# Altium schematic sheet Sheet1.SchDoc
size A2; SheetNumber: 1; SheetTotal: 1
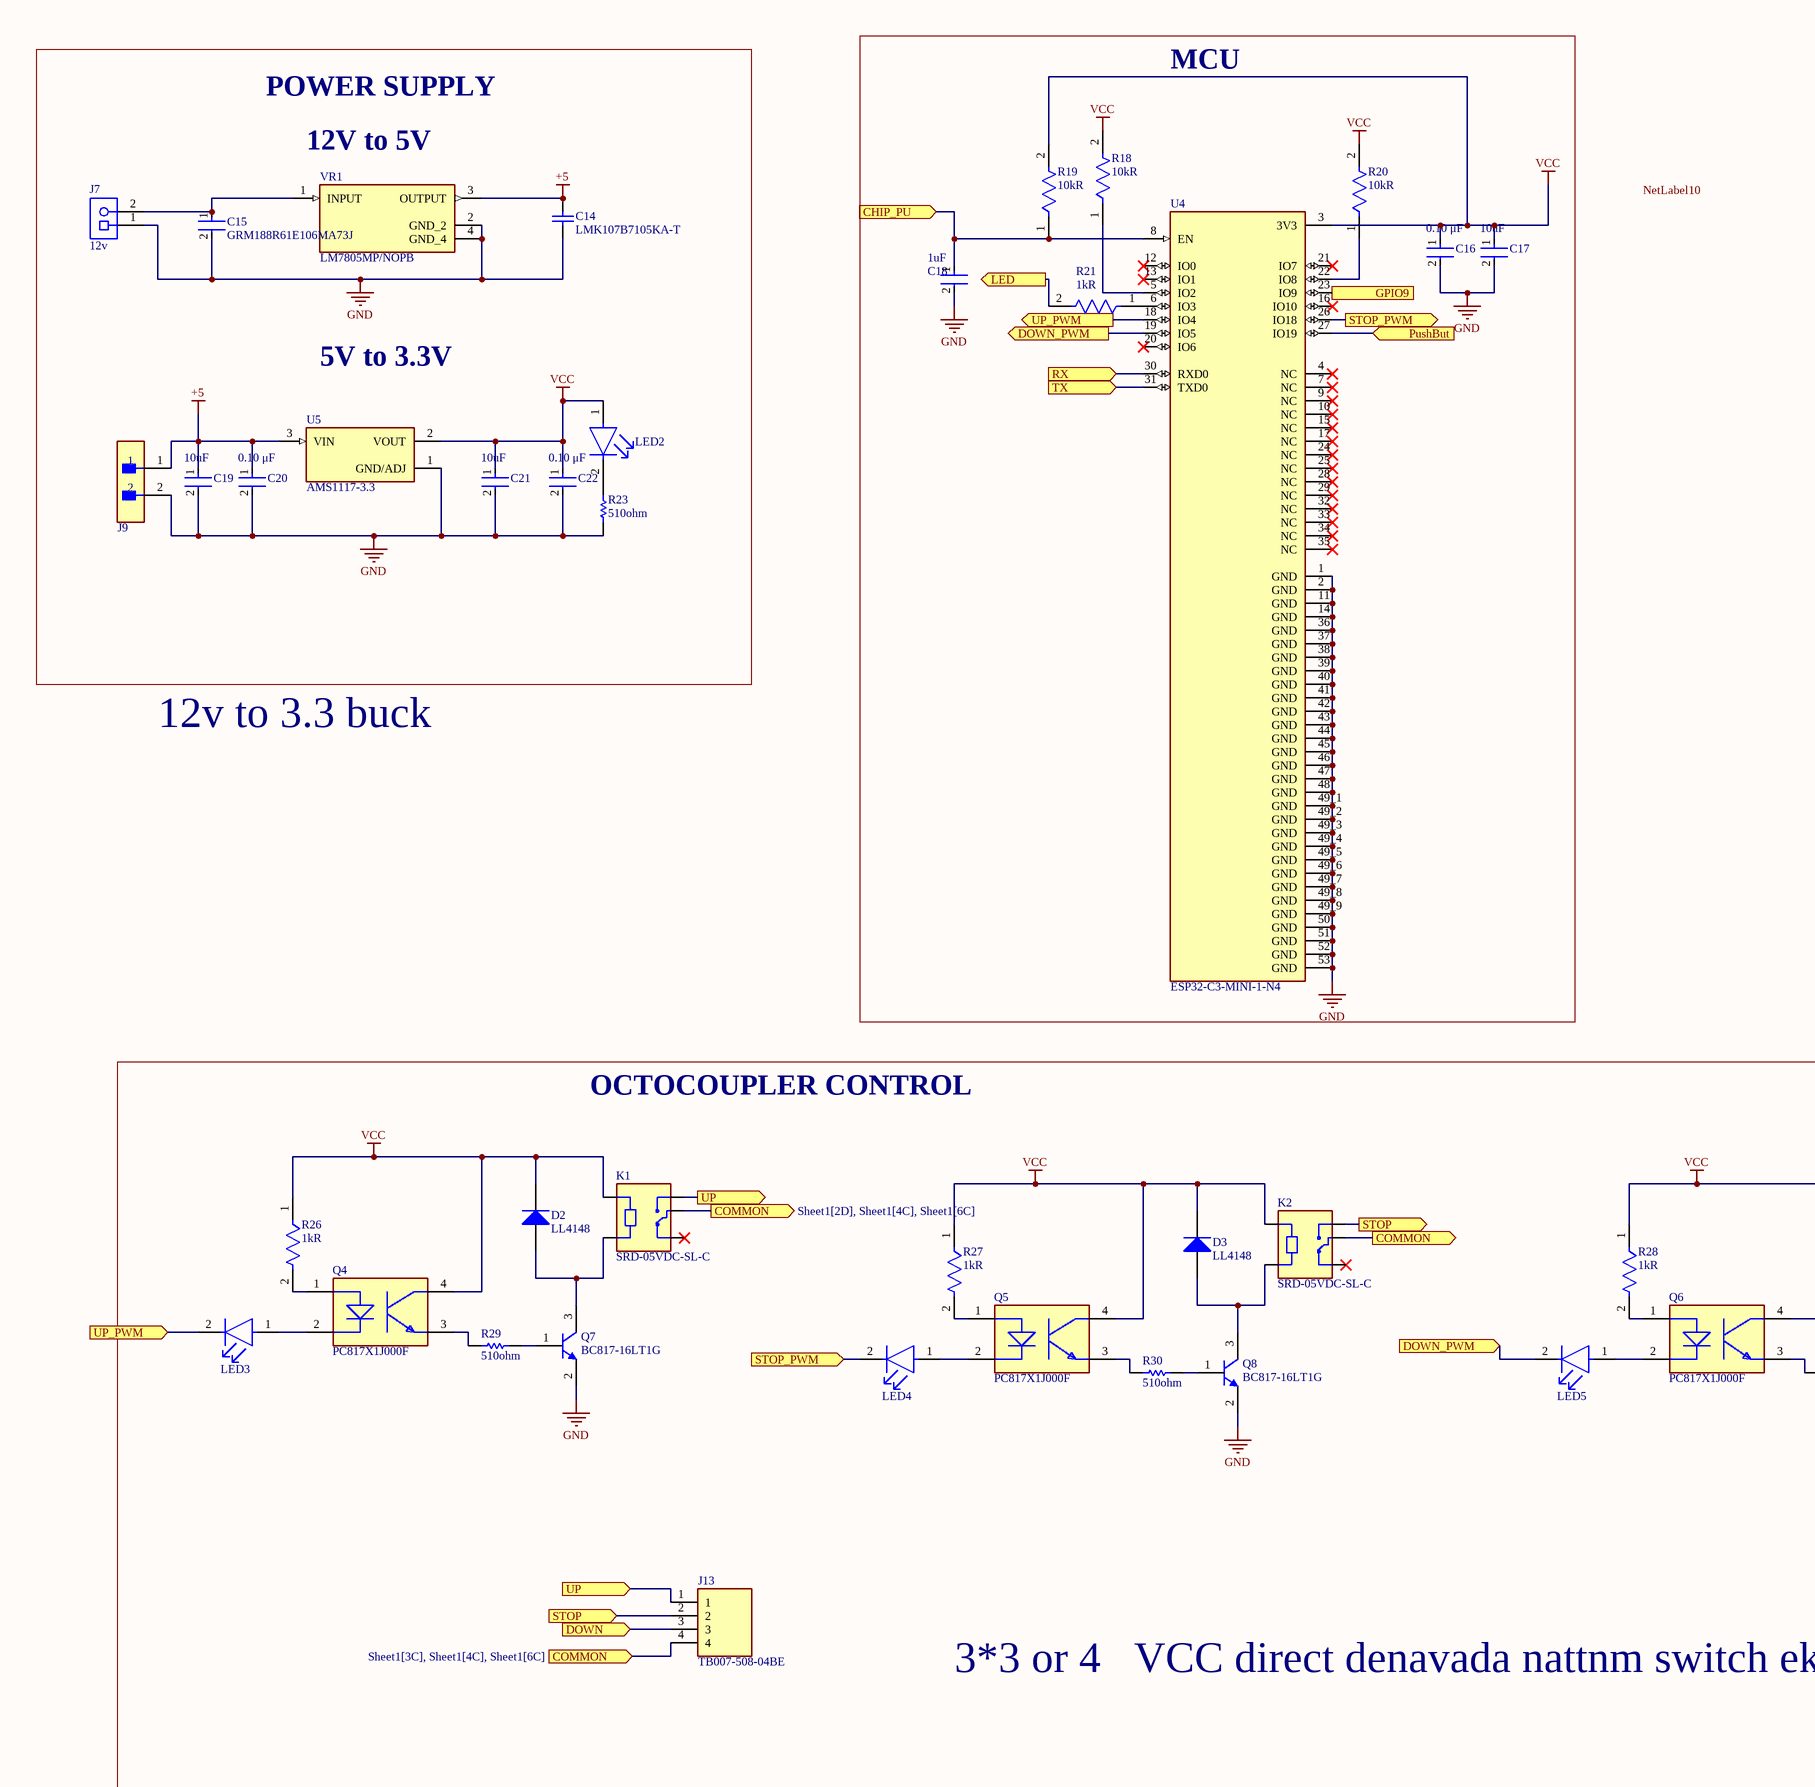
[diagram p0: Sheet1.SchDoc, left]
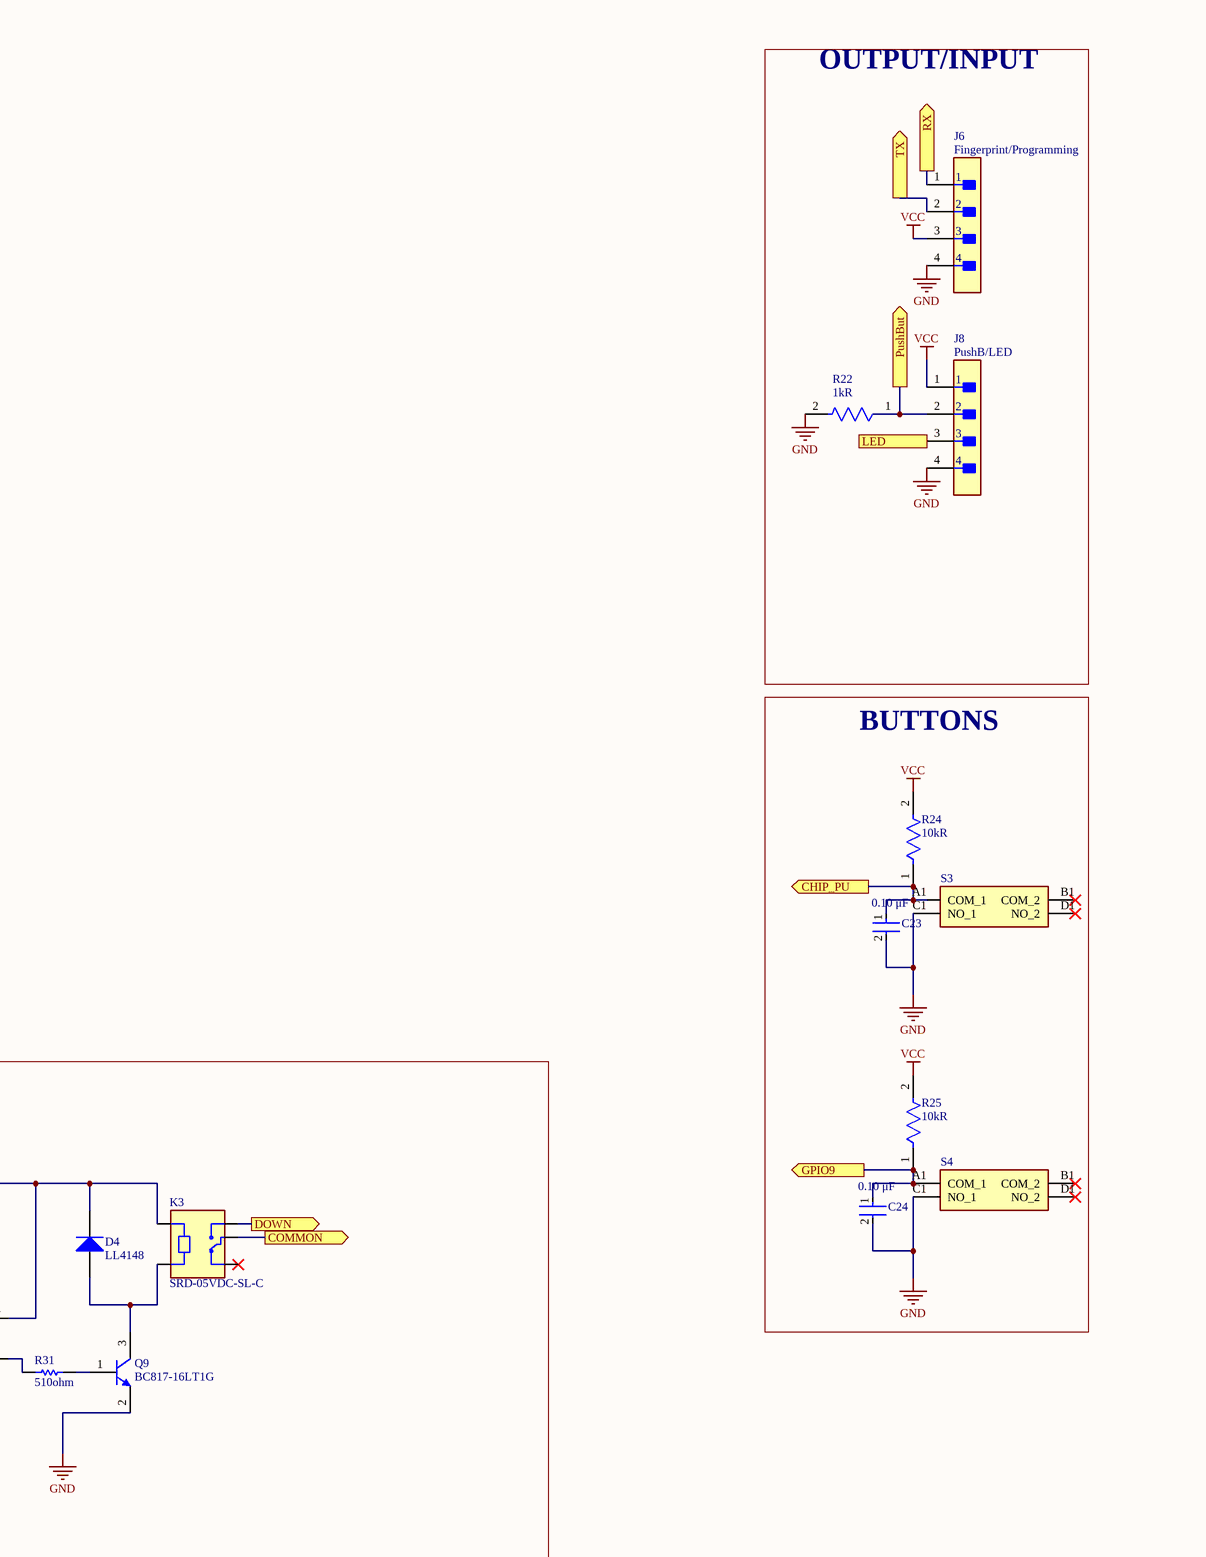
[diagram p1: Sheet1.SchDoc, right]

## Parts
C14  LMK107B7105KA-T  [CAPC1608X90X35NL10T25]
C15  GRM188R61E106MA73J  [FP-GRM188-0_2-MFG]
C16  Capacitance: 0.10 μF  [FP-C0603C-CF-MFG]  (hidden comment: C0603C104M4RAC7411)
C17  Capacitance: 10uF  [FP-CL10-IPC_A]  (hidden comment: CL10X106MO8NRNC)
C18  Capacitance: 1uF  [FP-0603-L_1_6_0_1-W_0_8_0-IPC_C]  (hidden comment: EMK107B7105KA-T)
C19  Capacitance: 10uF  [FP-CL10-IPC_A]  (hidden comment: CL10X106MO8NRNC)
C20  Capacitance: 0.10 μF  [FP-C0603C-CF-MFG]  (hidden comment: C0603C104M4RAC7411)
C21  Capacitance: 10uF  [FP-CL10-IPC_A]  (hidden comment: CL10X106MO8NRNC)
C22  Capacitance: 0.10 μF  [FP-C0603C-CF-MFG]  (hidden comment: C0603C104M4RAC7411)
C23  Capacitance: 0.10 μF  [FP-C0603C-CF-MFG]  (hidden comment: C0603C104M4RAC7411)
C24  Capacitance: 0.10 μF  [FP-C0603C-CF-MFG]  (hidden comment: C0603C104M4RAC7411)
D2  LL4148  [FAIR-SOD80-2_V]
D3  LL4148  [FAIR-SOD80-2_V]
D4  LL4148  [FAIR-SOD80-2_V]
J6  value Fingerprint/Programming  [FP-B4B-XH-A_LF_SN-MFG]  (hidden comment: B4B-XH-A(LF)(SN))
J7  Parameter 1: 12v  [PHOE-1729128-2_V]  (hidden comment: 1729128)
J8  value PushB/LED  [FP-B4B-XH-A_LF_SN-MFG]  (hidden comment: B4B-XH-A(LF)(SN))
J9  B2B-EH-A(LF)(SN)  [FP-B2B-EH-A_LF_SN-MFG]  (value not drawn)
J13  TB007-508-04BE  [CUI_TB007-508-04BE]
K1  SRD-05VDC-SL-C  [RELAY_SRD-05VDC-SL-C]
K2  SRD-05VDC-SL-C  [RELAY_SRD-05VDC-SL-C]
K3  SRD-05VDC-SL-C  [RELAY_SRD-05VDC-SL-C]
LED2  SM0805UBWC  [FP-SM0805UBWC-MFG]  (value not drawn)
LED3  SM0805UBWC  [FP-SM0805UBWC-MFG]  (value not drawn)
LED4  SM0805UBWC  [FP-SM0805UBWC-MFG]  (value not drawn)
LED5  SM0805UBWC  [FP-SM0805UBWC-MFG]  (value not drawn)
Q4  PC817X1J000F  [FP-PC817X1J000F-MFG]
Q5  PC817X1J000F  [FP-PC817X1J000F-MFG]
Q6  PC817X1J000F  [FP-PC817X1J000F-MFG]
Q7  BC817-16LT1G  [ONSC-SOT-23-3-318-08_V]
Q8  BC817-16LT1G  [ONSC-SOT-23-3-318-08_V]
Q9  BC817-16LT1G  [ONSC-SOT-23-3-318-08_V]
R18  Resistance: 10kR  [FP-ESR03-IPC_C]  (hidden comment: ESR03EZPJ103)
R19  Resistance: 10kR  [FP-ESR03-IPC_C]  (hidden comment: ESR03EZPJ103)
R20  Resistance: 10kR  [FP-ESR03-IPC_C]  (hidden comment: ESR03EZPJ103)
R21  Parameter 1: 1kR  [FP-ESR03-IPC_C]  (hidden comment: ESR03EZPJ103)
R22  Parameter 1: 1kR  [FP-ESR03-IPC_C]  (hidden comment: ESR03EZPJ103)
R23  Parameter 1: 510ohm  [RESC1609X50X30NL10T20]  (hidden comment: CRCW0603510RFKEA)
R24  Resistance: 10kR  [FP-ESR03-IPC_C]  (hidden comment: ESR03EZPJ103)
R25  Resistance: 10kR  [FP-ESR03-IPC_C]  (hidden comment: ESR03EZPJ103)
R26  Parameter 1: 1kR  [FP-ESR03-IPC_C]  (hidden comment: ESR03EZPJ103)
R27  Parameter 1: 1kR  [FP-ESR03-IPC_C]  (hidden comment: ESR03EZPJ103)
R28  Parameter 1: 1kR  [FP-ESR03-IPC_C]  (hidden comment: ESR03EZPJ103)
R29  Parameter 1: 510ohm  [RESC1609X50X30NL10T20]  (hidden comment: CRCW0603510RFKEA)
R30  Parameter 1: 510ohm  [RESC1609X50X30NL10T20]  (hidden comment: CRCW0603510RFKEA)
R31  Parameter 1: 510ohm  [RESC1609X50X30NL10T20]  (hidden comment: CRCW0603510RFKEA)
S3  TS-1187A-B-A-B  [TS1187ABAB]  (value not drawn)
S4  TS-1187A-B-A-B  [TS1187ABAB]  (value not drawn)
U4  ESP32-C3-MINI-1-N4  [XCVR_ESP32-C3-MINI-1-N4]
U5  AMS1117-3.3  [SOT229P700X180-4N]
VR1  LM7805MP/NOPB  [VREG_LM7805MP/NOPB]

## Blocks framed on the sheet
MCU: C16-C18 R18-R21 U4
OUTPUT/INPUT: J6 J8 R22
BUTTONS: C23 C24 R24 R25 S3 S4
OCTOCOUPLER CONTROL: D2-D4 J13 K1-K3 LED3-LED5 Q4-Q9 R26-R31

## Ports
CHIP_PU (in, see Sheet1[7B]), CHIP_PU (out, see Sheet1[3A]), COMMON (in, see Sheet1[3C], Sheet1[4C], Sheet1[6C]), COMMON (out, see Sheet1[2D], Sheet1[3C], Sheet1[4C]), COMMON (out, see Sheet1[2D], Sheet1[3C], Sheet1[6C]), COMMON (out, see Sheet1[2D], Sheet1[4C], Sheet1[6C]), DOWN (in, see Sheet1[6C]), DOWN (out, see Sheet1[2D]), DOWN_PWM (in, see Sheet1[3A]), DOWN_PWM (out, see Sheet1[4C]), GPIO9 (in, see Sheet1[7C]), GPIO9 (out, see Sheet1[4A]), LED (in, see Sheet1[3A]), LED (out, see Sheet1[8A]), PushBut (in, see Sheet1[8A]), PushBut (out, see Sheet1[4A]), RX (in, see Sheet1[8A]), RX (out, see Sheet1[3A]), STOP (in, see Sheet1[4C]), STOP (out, see Sheet1[2D]), STOP_PWM (in, see Sheet1[4A]), STOP_PWM (out, see Sheet1[3C]), TX (in, see Sheet1[8A]), TX (out, see Sheet1[3A]), UP (in, see Sheet1[2C]), UP (out, see Sheet1[2D]), UP_PWM (in, see Sheet1[3A]), UP_PWM (out, see Sheet1[1C])

## Nets
+5: C14.2 C19.1 C20.1 J9.1 U5.3(VIN) VR1.3(OUTPUT)
GND: C14.1 C15.2 C16.2 C17.2 C18.2 C19.2 C20.2 C21.2 C22.2 C23.2 C24.2 J6.4 J7.1 J8.4 J9.2 Q7.2(E) Q8.2(E) Q9.2(E) R22.2 R23.1 S3.C1(NO_1) S4.C1(NO_1) U4.1(GND) U4.2(GND) U4.11(GND) U4.14(GND) U4.36(GND) U4.37(GND) U4.38(GND) U4.39(GND) U4.40(GND) U4.41(GND) U4.42(GND) U4.43(GND) U4.44(GND) U4.45(GND) U4.46(GND) U4.47(GND) U4.48(GND) U4.49_1(GND) U4.49_2(GND) U4.49_3(GND) U4.49_4(GND) U4.49_5(GND) U4.49_6(GND) U4.49_7(GND) U4.49_8(GND) U4.49_9(GND) U4.50(GND) U4.51(GND) U4.52(GND) U4.53(GND) U5.1(GND/ADJ) VR1.2(GND_2) VR1.4(GND_4)
VCC: C16.1 C17.1 C21.1 C22.1 D2.2(K) D3.2(K) D4.2(K) J6.3 J8.1 K1.A1 K2.A1 K3.A1 LED2.1(A) Q4.4(C) Q5.4(C) Q6.4(C) R18.2 R19.2 R20.2 R24.2 R25.2 R26.1 R27.1 R28.1 U4.3(3V3) U5.2(VOUT)
CHIP_PU: C18.1 C23.1 R19.1 R24.1 S3.A1(COM_1) U4.8(EN) ; port CHIP_PU
COMMON: J13.4 K1.COM K2.COM K3.COM ; port COMMON
DOWN: J13.3 K3.NO ; port DOWN
DOWN_PWM: LED5.2(C) U4.19(IO5) ; port DOWN_PWM
GPIO9: C24.1 R25.1 S4.A1(COM_1) U4.23(IO9) ; port GPIO9
LED: J8.3 R21.2 ; port LED
PushBut: J8.2 R22.1 U4.27(IO19) ; port PushBut
RX: J6.1 U4.30(RXD0) ; port RX
STOP: J13.2 K2.NO ; port STOP
STOP_PWM: LED4.2(C) U4.26(IO18) ; port STOP_PWM
TX: J6.2 U4.31(TXD0) ; port TX
UP: J13.1 K1.NO ; port UP
UP_PWM: LED3.2(C) U4.18(IO4) ; port UP_PWM
NetC15_1: C15.1 J7.2 VR1.1(INPUT)
NetD2_1: D2.1(A) K1.A2 Q7.3(C)
NetD3_1: D3.1(A) K2.A2 Q8.3(C)
NetD4_1: D4.1(A) K3.A2 Q9.3(C)
NetLED2_2: LED2.2(C) R23.2
NetLED3_1: LED3.1(A) Q4.2(C)
NetLED4_1: LED4.1(A) Q5.2(C)
NetLED5_1: LED5.1(A) Q6.2(C)
NetQ4_1: Q4.1(A) R26.2
NetQ4_3: Q4.3(E) R29.2
NetQ5_1: Q5.1(A) R27.2
NetQ5_3: Q5.3(E) R30.2
NetQ6_1: Q6.1(A) R28.2
NetQ6_3: Q6.3(E) R31.2
NetQ7_1: Q7.1(B) R29.1
NetQ8_1: Q8.1(B) R30.1
NetQ9_1: Q9.1(B) R31.1
NetR18_1: R18.1 U4.5(IO2)
NetR20_1: R20.1 U4.22(IO8)
NetR21_1: R21.1 U4.6(IO3)

Not connected (* = marked no-connect by the designer): K1 NC*; K2 NC*; K3 NC*; S3 B1(COM_2)* D1(NO_2)*; S4 B1(COM_2)* D1(NO_2)*; U4 4(NC)* 7(NC)* 9(NC)* 10(NC)* 12(IO0)* 13(IO1)* 15(NC)* 16(IO10)* 17(NC)* 20(IO6)* 21(IO7)* 24(NC)* 25(NC)* 28(NC)* 29(NC)* 32(NC)* 33(NC)* 34(NC)* 35(NC)*

## Notes on the sheet
- POWER SUPPLY
- (near VR1) 12V to 5V
- 5V to 3.3V
- 12v to 3.3 buck
- 3*3 or 4   VCC direct denavada nattnm switch ekak vidiyata danavda  and led ekak damavda nadda?
- Labels drawn without touching a wire or pin: NetLabel10

## Library data of the parts
C14 = CMP-2000-05445-2: None; Dielectric: X7R; Tolerance: 10%; Voltage Rating: 10V; Capacitance: 1uF; Halogen Free: Halogen Free; Construction: Flat; Max Operating Temperature: 125°C; Packaging: Tape and Reel; REACH SVHC: No SVHC; Width: 0.031inch; Case/Package: 0603; Number of Pins: 2; Resistor Type: Ceramic; Case Code (Imperial): 0603; Termination: SMD/SMT; RoHS Compliant: Yes; Depth: 0.8mm; Height: 0.8mm; Mount: Surface Mount; Case Code (Metric): 1608; Voltage Rating (DC): 10V; Series: M; Length: 1.6mm; Radiation Hardening: No; Lead Free: Lead Free; Min Operating Temperature: -55°C; Thickness: 0.035inch; Package Quantity: 1
C15 = CMP-06035-029786-1: Chip Multilayer Ceramic Capacitors for General Purpose, 0603, 10uF, X5R, 15%, 20%, 25V; Termination: SMD/SMT; Weight: 0.000222oz; Mount: Surface Mount; Package Quantity: 10000; Voltage Rating (DC): 25V; Length: 0.063inch; Case Code (Metric): 1608; Thickness: 0.039inch; Height: 0.8mm; Resistor Type: Ceramic; Dielectric: X5R; Case/Package: 0603; Tolerance: 20%; Packaging: Tape and Reel; Width: 0.031inch; Case Code (Imperial): 0603; Max Operating Temperature: 85°C; Min Operating Temperature: -55°C; Voltage Rating: 25V; Capacitance: 10uF
C16 C20 C22-C24 = CMP-03020-016578-1: CAP CER 0.1UF 16V X7R 0603; Manufacturer: KEMET; Tolerance: 0.2; Value: 0.10 μF; Automotive Grade: Grade 1; Material: Ceramic; Temperature Coefficient: 30ppm/°C; RoHS: TRUE; Temperature: -55°C to +125°C; Automotive: Yes; Device Class L3: Ceramic Capacitors; Temperature Characteristic: X7R; Package: C0603C-CF; Digikey Description: CAP CER 0.1UF 16V X7R 0603; Manufacturer Part Number: C0603C104M4RAC7411; ComponentLink2URL: https://api.kemet.com/component-edge/download/datasheet/C0603C100J5GACAUTO.pdf; Mouser Description: Multilayer Ceramic Capacitors MLCC - SMD/SMT 16volts 0.1uF X7R 20%; Voltage Rating: 16 V; Temperature Range High: +125°C; Temperature Range Low: -55°C; Height: 0.87mm; Device Class L1: Passive Components; ComponentLink2Description: Datasheet; Lead Free: Yes; Category: Cap; Device Class L2: Capacitors; Octopart: https://octopart.com/c0603c104m4rac7411-kemet-9138805
C17 C19 C21 = CMP-13271-003287-1: Cap Ceramic 10uF 16V X6S ±20% Pad SMD 0603 +105°C T/R; Thickness: 0.035inch; Mount: Surface Mount; Length: 0.063inch; Voltage Rating: 16V; Case Code (Imperial): 0603; Case/Package: 0603; Max Operating Temperature: 105°C; Tolerance: 20%; Case Code (Metric): 1608; Width: 0.031inch; Min Operating Temperature: -55°C; Packaging: Tape and Reel
C18 = CMP-14477-000018-3: None; Voltage Rating (DC): 16V; Dielectric: X7R; Tolerance: 10%; Halogen Free: Halogen Free; Height: 0.8mm; REACH SVHC: No SVHC; Contact Plating: Nickel; Number of Pins: 2; Resistor Type: Ceramic; Series: M; Thickness: 0.035inch; Construction: Flat; Voltage Rating: 16V; Packaging: Tape and Reel; Width: 0.031inch; Length: 1.6mm; Case Code (Metric): 1608; RoHS Compliant: Yes; Termination: SMD/SMT; Min Operating Temperature: -55°C; Case/Package: 0603; Mount: Surface Mount; Case Code (Imperial): 0603; Depth: 0.8mm; Package Quantity: 1; Max Operating Temperature: 125°C; Lead Free: Lead Free; Radiation Hardening: No
D2-D4 = CMP-2000-05115-2: Small Signal Diode, 100 V, 0.2 A, -55 to 175 degC, 2-Pin SOD80, RoHS, Tape and Reel; Manufacturer: Fairchild; Reverse Voltage-Max [Vrrm]: 100V; Average Forward Current-Max: 200mA; Forward Voltage: 1V; Reverse Recovery Time-Max: 1ns; Power Dissipation: 500mW; Datasheet URL: https://www.fairchildsemi.com/datasheets/LL/LL4148.pdf; Manufacturer URL: https://www.fairchildsemi.com/; Datasheet Version: Rev. 1.8, 01/2016
J6 J8 = CMP-17439-000250-1: CONN HEADER VERT 4POS 2.5MM; Number of Contacts: 4; Contact Resistance: 20mR; Voltage Rating: 250V; Max Current Rating: 3A; Gender: Male; Wire/Cable Gauge: 22AWG; Mated Stacking Heights: 9.8mm; Insulation Resistance: 1GR; Orientation: Straight; Contact Type: Male Pin; Contact Finish - Mating: TIN; Series: XH; Max Voltage Rating (AC): 250V; Lead Pitch: 2.5mm; Contact Shape: Square; Insulation Color: Natural; Termination: Solder; Lead Free: Lead Free; Voltage Rating (AC): 250V; Number of Rows: 1; Flammability Rating: UL94 V-0; Number of Positions: 4; Max Operating Temperature: 85°C; Package Quantity: 500; Mount: Through Hole; REACH SVHC: No SVHC; Connector Type: Header; Insulation Material: Nylon; Fastening Type: Detent; Min Operating Temperature: -25°C; Housing Color: White; Packaging: Bulk; Contact Plating: Tin; Contact Material: Brass; Max Voltage Rating (DC): 250V; Housing Material: Polyamide; Color: Natural; Material: Polyamide; Pitch: 2.5mm; Depth: 5.75mm; Current Rating: 3A; Length: 12.4mm
J7 = CMP-2000-05815-1: PCB Terminal Block, 13.5 A, 400 V, 2-Pin THD, RoHS, Bulk; Manufacturer: Phoenix Contact; Package Version: 03/2015; No. of Rows: 1; Pitch: 5.08mm; No. of Positions: 2; Voltage Rating: 400V; Current Rating: 13500mA; Manufacturer URL: http://www.phoenixcontact.com/; Datasheet URL: https://datasheet.ciiva.com/16046/1729128-16046181.pdf; RoHS: TRUE; Package URL: https://www.phoenixcontact.com/online/portal/pi/pxc/product_detail_page/!ut/p/b1/3VdJjqNKFDxLH8AFycySyWY2ozFsEPOMMQaDOX1XedGL_1Vdm5YXJleknhSKeBkvI6EA8ncAo3AYoDhBQGco6KN7VURTdemj9us_IEKEZo_YHiPAEWEFmDGOHMORkqKYCORBZxgL7ZoaZYcbFFUZ3fqxSY6GOuxydWUuHqz1ynmMFygu583Bob0Ewr6Sd_l-5m-kAueHiB0jpRwZwe58wwtkpxtMYd_LmGcDRU02dRNEyWt6Y2ti5pSyJ_reIkzIulrqApdnbT11V5jnCKbYNCvhEM1MCpPByat_X379-iThf08CI5GfOPqfBeS3BRoBOdD55AKVv0iLwCMq-2BrzXWSGRH7pUGD9uwXQjiph3xL0DKQwdGa0JImiIOmBNOestqgwTHSSs2oOep-78apyXQBvNi8ZLaFjvjWvcaUEBu0MC6Wbe-d6mB0FAebo2lUWinqYaZs5DAYzV0RP9yitUjnGJ0iI9xhZkT42OCQNUJJhkgWINNQLP2JFP6OpMg3JCVg70jqHT0lvKOnhHf0lPuOnnLf0VPuWx6_dxwUIvwk5WMkT0kLL1mh61l2yZVSzG3pYV_bqo-mj6uMKwKwdnnW8Jh5RTOJzMOA5c-eJDaZQw4mTMPH02PvS_ZAqNVjVTo2WyYLkwH_KU1mmmG5kjRhDqPXLwwVHvVOjCM60-fpXvTDfMGW1PVFVS1r4e4yVDk4ZdNbkUHvqPqQSeian4UD39fNKmachqdJ1NJbyk8rXT9mXTvPk3oE5meulKGgiruPJek-4I9hTT6G8ZLOyRSm2RRVbThERQad5OS28hdt4YW4vG0stgYYzsWsK4_7y6DZMjJSCqri1kyiZR5vD7pwIrNR7QwPHTcLTI5qT7eRlpHrdGiupYlqQDJ7zy_CND8fWWBoLRXxk1RVcXiBQwbTD4Xi7KL-FuO94t9xaqweXzH; PartNumber: 1729128; Package Description: 2-Pin Through Hole Device, Body 8.1 x 10.16 mm, Pitch 5.08 mm; Datasheet Version: 12/2013; Mounting Technology: ThroughHole; Orientation: Horizontal; Package Reference: 1729128-2; Packing: Bulk
J9 = CMP-17439-000026-1: CONN HEADER VERT 2POS 2.5MM; Number of Contacts: 2; Current Rating: 3A; Connector Type: Plug; Contact Resistance: 20mR; Gender: Male; Voltage Rating: 250V; Fastening Type: Detent; Depth: 3.8mm; Max Operating Temperature: 85°C; Orientation: Straight; Series: EH; Contact Plating: Tin; Min Operating Temperature: -25°C; Contact Type: Male Pin; Housing Color: White; Termination: Press-Fit; Housing Material: Nylon; Pitch: 2.5mm; Number of Positions: 2; Max Current Rating: 3A; Packaging: Bulk; Lead Free: Lead Free; Number of Rows: 1; Length: 7.5mm; Contact Mating Length: 0.13inch; Color: Natural; Max Voltage Rating (AC): 250V; Contact Material: Copper Alloy; Mount: Through Hole
J13 = TB007-508-04BE: 2 ~ 24 polos, tipo tornillo, horizontal, paso de 5.08, 24 ~ 12 (AWG), conector de bloque de terminales; MF: Same Sky; SnapEDA_Link: https://www.snapeda.com/parts/TB007-508-04BE/Same+Sky/view-part/?ref=snap; Package: None; Value: *; MP: TB007-508-04BE; Check_prices: https://www.snapeda.com/parts/TB007-508-04BE/Same+Sky/view-part/?ref=eda
K1-K3 = SRD-05VDC-SL-C: 5V Trigger Relay Module For Arduino And Raspberry Pi 5V Trigger Relay Module For Arduino And Raspberry Pi; MF: Songle Relay; Check_prices: https://www.snapeda.com/parts/SRD-05VDC-SL-C/Songle+Relay/view-part/?ref=eda; Value: *; Availability: Not in stock; Price: None; Package: NON STANDARD-5 Songle Relay; MP: SRD-05VDC-SL-C; SnapEDA_Link: https://www.snapeda.com/parts/SRD-05VDC-SL-C/Songle+Relay/view-part/?ref=snap
LED2-LED5 = CMP-35283-000004-1: LED BLUE CLEAR 0805 SMD; Dominant Wavelength: 470nm; Forward Voltage: 3.3V; Forward Current: 20mA; Lens Color: Colorless; Lens Style: Rectangular; Luminous Intensity: 115mcd; Viewing Angle: 130°; Power Rating: 100mW; Lens Transparency: Clear; Height: 1.1mm; Mount: Surface Mount; Packaging: Tape and Reel; Package Quantity: 3000; Illumination Color: Blue; Width: 1.2mm; Min Operating Temperature: -30°C; Case Code (Imperial): 0805; Length: 2mm; Test Current: 20mA; Max Operating Temperature: 80°C; Case Code (Metric): 2012; Color: Blue; Wavelength: 470nm; Case/Package: 0805; Lead Free: Lead Free; Number of Pins: 2
Q4-Q6 = CMP-65434-000003-1: OPTOISOLATOR 5KV TRANS 4DIP; Collector Emitter Saturation Voltage: 200mV; Forward Voltage: 1.4V; Power Dissipation: 200mW; Input Current: 20mA; Max Collector Current: 50mA; Collector Emitter Breakdown Voltage: 80V; Rise Time: 18000ns; Number of Elements: 1; Reverse Breakdown Voltage: 6V; Current Transfer Ratio: 600%; Min Operating Temperature: -30°C; Number of Pins: 4; Radiation Hardening: No; Output Current per Channel: 50mA; Case/Package: DIP; Fall Time: 18000ns; Forward Current: 50mA; Isolation Voltage: 5kV; Package Quantity: 2000; Max Operating Temperature: 100°C; Packaging: Sleeve; Max Input Current: 50mA; Output Voltage: 80V; Max Power Dissipation: 200mW; Mount: Through Hole; Number of Channels: 1; Collector Emitter Voltage (VCEO): 80V
Q7-Q9 = CMP-1048-00736-1: General Purpose Transistor, NPN Silicon, 3-Pin SOT-23, Pb-Free, Tape and Reel; Manufacturer: On Semiconductor; IC Continuous (A): 0.5; fT Min (MHz): 100; PartNumber: BC817-16LT1G; Mounting Technology: Surface Mount; PackageVersion: Rev. AP, 11/2009; ComponentLink3Description: Package Specification; PackageReference: SOT-23-3-318-08; Packing: Tape and Reel; ComponentLink1URL: http://www.onsemi.com/; Polarity: NPN; RoHS: TRUE; ComponentLink2URL: http://www.onsemi.com/pub_link/Collateral/BC817-16LT1-D.PDF; ComponentLink3URL: http://www.onsemi.cn/pub_link/Collateral/318-08.PDF; ComponentLink2Description: Datasheet; PackageDescription: 3-Pin Small Outline Transistor, Body 2.92 x 1.3 mm, Pitch 0.95 mm; ComponentLink1Description: Manufacturer URL; DatasheetVersion: Rev. 12
R18-R20 R24 R25 = CMP-08839-028975-1: 10kΩ ±5% 0.25W 0603 Anti-Surge Chip Resistor AEC-Q200; Power Rating: 250mW; Temperature Coefficient: 200ppm/°C; Tolerance: 5%; Series: ESR03; Package Quantity: 5000; Length: 0.063inch; Height: 0.022inch; Lead Free: Lead Free; Case/Package: 0603; Case Code (Metric): 1608; Width: 0.031inch; Resistor Type: Thick Film; Max Power Dissipation: 250mW; Packaging: Tape and Reel; Mount: Surface Mount; Number of Terminations: 2; Case Code (Imperial): 0603; Max Operating Temperature: 155°C; Min Operating Temperature: -55°C; RoHS Compliant: Yes
R21 R22 R26-R28 = CMP-08839-028975-1: 10kΩ ±5% 0.25W 0603 Anti-Surge Chip Resistor AEC-Q200; Resistance: 10kR; Power Rating: 250mW; Temperature Coefficient: 200ppm/°C; Tolerance: 5%; Series: ESR03; Package Quantity: 5000; Length: 0.063inch; Height: 0.022inch; Lead Free: Lead Free; Case/Package: 0603; Case Code (Metric): 1608; Width: 0.031inch; Resistor Type: Thick Film; Max Power Dissipation: 250mW; Packaging: Tape and Reel; Mount: Surface Mount; Number of Terminations: 2; Case Code (Imperial): 0603; Max Operating Temperature: 155°C; Min Operating Temperature: -55°C; RoHS Compliant: Yes
R23 R29-R31 = CMP-2000-03439-1: Manufacturer: Vishay Dale; Part Number: CRCW0603510RFKEA
S3 S4 = TS-1187A-B-A-B: Switch; Manufacturer_Name: XKB Connectivity; Datasheet Link: http://www.helloxkb.com/public/images/pdf/TS-1187A-X-X-X.pdf; Height: 4.05mm; Manufacturer_Part_Number: TS-1187A-B-A-B
U4 = ESP32-C3-MINI-1-N4: Bluetooth, WiFi 802.11b/g/n, Bluetooth v5.0 Transceiver Module 2.412GHz ~ 2.484GHz PCB Trace Surface Mount; MF: Espressif Systems; SnapEDA_Link: https://www.snapeda.com/parts/ESP32-C3-MINI-1-N4/Espressif+Systems/view-part/?ref=snap; Package: SMD-53 Espressif Systems; Value: *; MP: ESP32-C3-MINI-1-N4; Check_prices: https://www.snapeda.com/parts/ESP32-C3-MINI-1-N4/Espressif+Systems/view-part/?ref=eda
U5 = AMS1117-3.3: Sot223/Pkg 1-Amp 3.3-Volt Low Drop Out Voltage Regulatator; MF: Advanced Monolithic Systems; Package: SOT-223 Seeed Technology; Value: *; Check_prices: https://www.snapeda.com/parts/AMS1117-3.3/Advanced+Monolithic+Systems/view-part/?ref=eda; Price: None; Availability: Not in stock; MP: AMS1117-3.3; SnapEDA_Link: https://www.snapeda.com/parts/AMS1117-3.3/Advanced+Monolithic+Systems/view-part/?ref=snap
VR1 = LM7805MP/NOPB: 1.5-A, 30-V, linear voltage regulator; MF: Texas Instruments; SnapEDA_Link: https://www.snapeda.com/parts/LM7805MP/NOPB/Texas+Instruments/view-part/?ref=snap; Package: SOT-223-4 Texas Instruments; Value: *; MP: LM7805MP/NOPB; Check_prices: https://www.snapeda.com/parts/LM7805MP/NOPB/Texas+Instruments/view-part/?ref=eda